# Altium schematic sheet CanTransceiver.SchDoc
size A; SheetNumber: 5; SheetTotal: 5
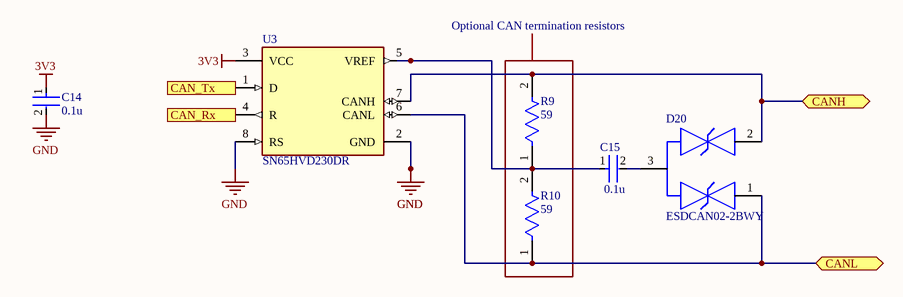
[diagram p0: CanTransceiver.SchDoc]

## Parts
C14  0.1u  [FP-C0603C-CF-MFG]
C15  0.1u  [FP-C0603C-CF-MFG]
D20  ESDCAN02-2BWY  [FP-SOT323-3L-MFG]
R9  59  [FP-CRCW0805-e3-IPC_B]
R10  59  [FP-CRCW0805-e3-IPC_B]
U3  SN65HVD230DR  [FP-D0008A-IPC_A]

## Ports
CAN_Rx (out), CAN_Tx (in), CANH (bidir), CANL (bidir)

## Nets
3V3: C14.1 U3.3(VCC)
GND: C14.2 U3.2(GND) U3.8(RS)
CAN_Rx: U3.4(R) ; port CAN_Rx
CAN_Tx: U3.1(D) ; port CAN_Tx
CANH: D20.2 R9.2 U3.7(CANH) ; port CANH
CANL: D20.1 R10.1 U3.6(CANL) ; port CANL
NetC15_1: C15.1 R9.1 R10.2 U3.5(VREF)
NetC15_2: C15.2 D20.3

## Notes on the sheet
- Optional CAN termination resistors

## Library data of the parts
C14 C15 = CMP-2006-03061-2: CAP CER 0.1UF 50V X7R 0603; Manufacturer: KEMET; Manufacturer Part Number: C0603C104K5RACTU; Tolerance: 0.1; Temperature Coefficient: 30ppm/°C; Material: Ceramic; Automotive Grade: Grade 1; Value: 0.10 μF; Temperature: -55°C to +125°C; RoHS: TRUE; Temperature Range High: +125°C; Lead Free: Yes; Octopart: https://octopart.com/c0603c104k5ractu-kemet-139244; Digikey Description: CAP CER 0.1UF 50V X7R 0603; Category: Cap; Package: C0603C-CF; ComponentLink2Description: Datasheet; Temperature Range Low: -55°C; Device Class L1: Passive Components; Voltage Rating: 50 V; Automotive: Yes; Device Class L3: Ceramic Capacitors; ComponentLink2URL: https://api.kemet.com/component-edge/download/datasheet/C0603C100J5GACAUTO.pdf; Capacitance: 0.10 μF; Device Class L2: Capacitors; Temperature Characteristic: X7R; Height: 0.87mm
D20 = CMP-12225-000055-1: TVS DIODE 26.5V 44V SOT323-3; Manufacturer: STMicroelectronics; Value: 3pF; Direction: Bidirectional; Breakdown Voltage: 28.5V; Automotive Grade: Grade 0; Standoff Height: 0mm; Peak Pulse Power: 170W; Peak Pulse Current: 3A; Number Of Channels: 2; Max Junction Temp: +175°C; Mouser Description: TVS Diodes / ESD Suppressors Automotive dual-line Transil, Transient voltage suppressor (TVS) for CAN bus; Height: 1.1mm; Category: Diode; Reverse Standoff Voltage: 26.5V; Device Class L1: Circuit Protection; Temperature: -55°C to +175°C; RoHS: TRUE; ComponentLink2URL: https://www.st.com/resource/en/datasheet/esdcan02-2bwy.pdf; Device Class L3: unset; Device Class L2: TVS Diodes; Temperature Range High: +175°C; Octopart: https://octopart.com/esdcan02-2bwy-stmicroelectronics-58631133; Ipc Land Pattern Name: SOT65P210X95-3; Temperature Range Low: -55°C; Capacitance: 3pF; Digikey Description: TVS DIODE 26.5V 44V SOT323-3; Automotive: Yes; ComponentLink2Description: Datasheet; Clamping Voltage: 44V; Manufacturer Part Number: ESDCAN02-2BWY; Lead Free: Yes; Package: SOT323-3L
R9 R10 = CMP-02407-002414-1: RES Thick Film, 59Ω, 1%, 0.125W, 100ppm/°C, 0805; Power Rating: 125mW; Voltage Rating (DC): 150V; Resistance: 59R; Length: 2mm; Mount: Surface Mount; Military Standard: Not; Min Operating Temperature: -55°C; Number of Pins: 2; Height: 0.02inch; Weight: 0.000194oz; Case Code (Metric): 2012; Features: Automotive AEC-Q200; Width: 1.25mm; Tolerance: 1%; Max Operating Temperature: 155°C; Temperature Coefficient: 100ppm/°C; Depth: 1.25mm; Termination: SMD/SMT; Package Quantity: 10; Number of Terminations: 2; Packaging: Tape and Reel; Radiation Hardening: No; Composition: Thick Film; Lead Free: Lead Free; Case Code (Imperial): 0805; Case/Package: 0805; Contact Plating: Tin; Max Power Dissipation: 125mW; Voltage Rating: 150V
U3 = CMP-0315-00015-3: IC TRANSCEIVER HALF 1/1 8SOIC; Number of Transceivers: 1; Operating Supply Voltage: 3.3V; Number of I/Os: 2; Max Supply Current: 17mA; Max Supply Voltage: 3.6V; Min Supply Voltage: 3V; Data Rate: 1Mbps; Min Operating Temperature: -40°C; Packaging: Tape and Reel; Lead Free: Lead Free; Number of Transmit Buffers: 1; Max Operating Temperature: 85°C; Number of Receive Buffers: 1; Number of Pins: 8; Package Quantity: 1; Radiation Hardening: No; Case/Package: D; REACH SVHC: No SVHC; Weight: 0.002561oz; Termination: SMD/SMT; Contact Plating: Gold; Nominal Supply Current: 17mA; Number of Receivers: 1; Number of Drivers: 1